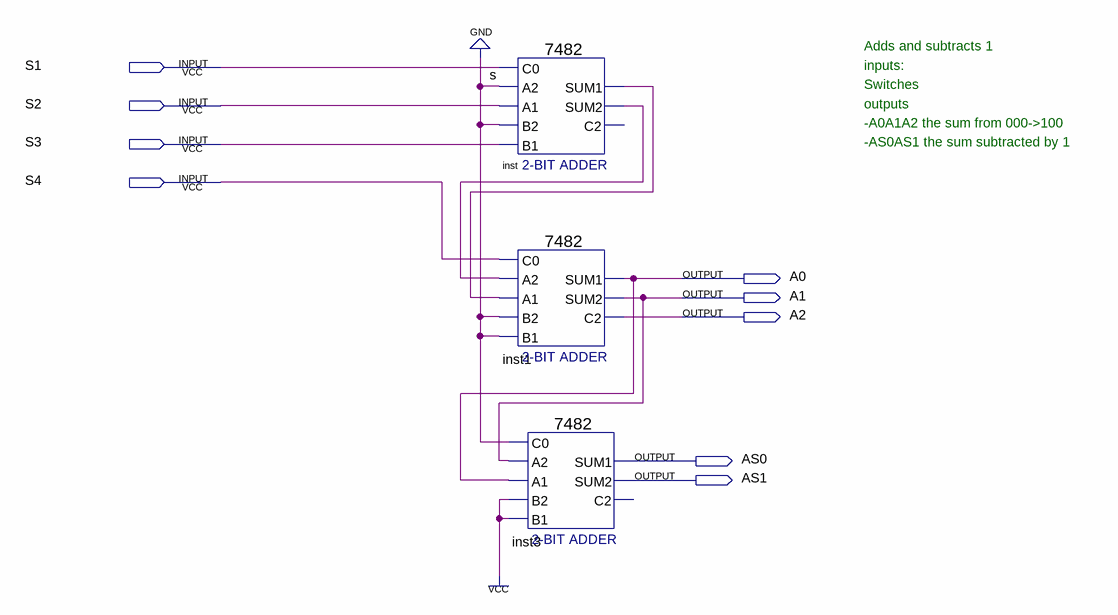
[diagram p0: schematic sheet]
// Quartus schematic AdderSub.bdf as structural Verilog: 3 symbols, 9 pins
module AdderSub (
  input  S1,
  input  S2,
  input  S3,
  input  S4,
  output A0,
  output A1,
  output A2,
  output AS0,
  output AS1
);

  wire inst_sum1, inst_sum2;

  \7482  inst (.A2(1'b0), .B2(1'b0), .B1(S3), .C0(S1), .A1(S2), .SUM1(inst_sum1), .SUM2(inst_sum2));  // open: C2
  \7482  inst1 (.A2(inst_sum2), .B2(1'b0), .B1(1'b0), .C0(S4), .A1(inst_sum1), .C2(A2), .SUM1(A0), .SUM2(A1));
  \7482  inst3 (.A2(A1), .B2(1'b1), .B1(1'b1), .C0(1'b0), .A1(A0), .SUM1(AS0), .SUM2(AS1));  // open: C2

  // Notes on the sheet:
  //   Adds and subtracts 1
  //   inputs:
  //   Switches
  //   outputs
  //   -A0A1A2 the sum from 000->100
  //   -AS0AS1 the sum subtracted by 1
endmodule
